# EAGLE design lightbar control (EAGLE 6.5.0)
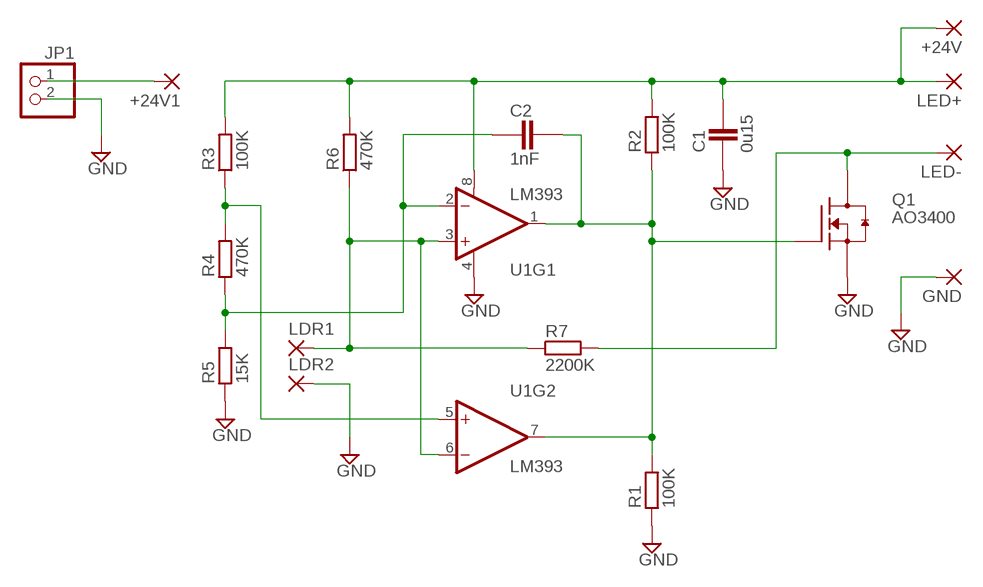
[diagram p0: schematic, sheet 1]

## Parts
+24V  SMD2  [SMD1,27-2,54]
+24V1  SMD2  [SMD1,27-2,54]
C1  0u15  CAPACITOR_0805  [CAPC2012X145AN]
C2  1nF  CAPACITOR_0603  [CAPC1608X92N]
GND  SMD2  [SMD1,27-2,54]
JP1  PINHD-1X2/90  [1X02/90]
LDR1  SMD2  [SMD1,27-2,54]
LDR2  SMD2  [SMD1,27-2,54]
LED+  SMD2  [SMD1,27-2,54]
LED-  SMD2  [SMD1,27-2,54]
Q1  AO3400  MOSFET-NCH_SOT-23  [SOT95P280X135-3N]
R1  100K  RESISTOR_0603  [RESC1608X55N]
R2  100K  RESISTOR_0603  [RESC1608X55N]
R3  100K  RESISTOR_0603  [RESC1608X55N]
R4  470K  RESISTOR_0603  [RESC1608X55N]
R5  15K  RESISTOR_0603  [RESC1608X55N]
R6  470K  RESISTOR_0603  [RESC1608X55N]
R7  2200K  RESISTOR_0805  [RESC2012X70N]
U1  LM393  [SO08]

## Nets
GND: C1.1 GND.1(P) JP1.2 LDR2.1(P) Q1.2(S) R1.1 R5.1 U1.4(V-)
N$1: C2.2 Q1.1(G) R1.2 R2.1 U1.1(OUT) U1.7(OUT)
N$2: LDR1.1(P) R6.1 R7.1 U1.3(+IN) U1.6(-IN)
N$3: R3.1 R4.2 U1.5(+IN)
N$4: +24V.1(P) C1.2 LED+.1(P) R2.2 R3.2 R6.2 U1.8(V+)
N$5: C2.1 R4.1 R5.2 U1.2(-IN)
N$6: LED-.1(P) Q1.3(D) R7.2
N$7: +24V1.1(P) JP1.1

## Library data of the parts
+24V +24V1 GND LDR1 LDR2 LED+ LED- = wirepad:SMD2: SMD PAD
C1 C2 = ipc-7351-capacitor:CAPACITOR_
JP1 = pinhead:PINHD-1X2: PIN HEADER
Q1 = ipc-7351-transistor:MOSFET-NCH_
R1-R7 = ipc-7351-resistor:RESISTOR_
U1 = SparkFun-AnalogIC:LM393: Low-voltage comparator

## Board
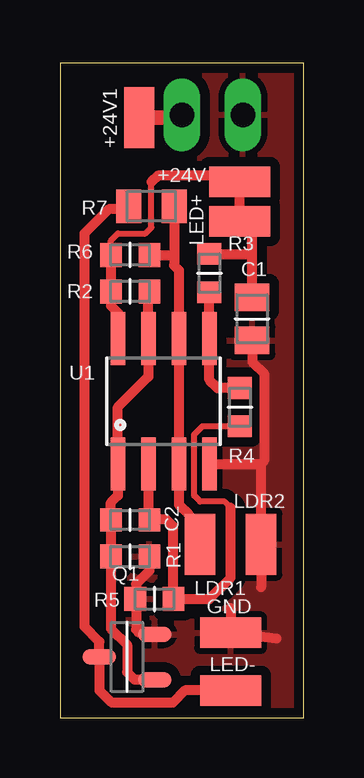
[diagram p1: board, top side]
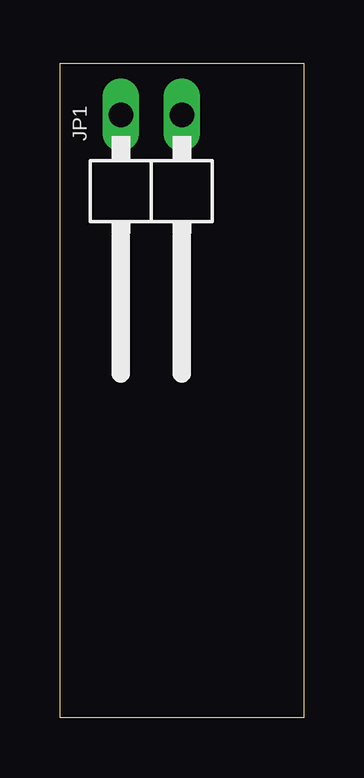
[diagram p2: board, bottom side, seen from below]

Size 10.16 x 27.3 mm. Coordinates in mm from the lower left corner, seen from the top.
Outline: 0,0 10.16,0 10.16,27.3 0,27.3 0,0
Copper layers (1*16): Top 0.035559375mm / dielectric 1.6mm / Bottom 0.035559375mm
Design rules "oshpark-2layer-tented-vias": minimum track width 6mil, minimum drill 10mil, track to track 6mil, track to pad 6mil, pad to pad 6mil, via to via 6mil, smd to smd 6mil, copper to edge 15mil, drill to drill 6mil, minimum pad ring 5mil, minimum via ring 5mil, stop-mask expansion 2.5mil, vias tented up to drill 13mil, thermal gap 10mil

### Footprints (pad centres in the part's own frame; a part is rotated, then mirrored left to right if it is on the bottom)
SMD1,27-2,54 = smd 1.27 x 2.54: 1 0,0
CAPC2012X145AN = smd 1.15 x 1.45: 1 -0.9,0; 2 0.9,0
CAPC1608X92N = smd 0.9 x 0.95: 1 -0.8,0; 2 0.8,0
1X02/90 = drill 1.016 long: 1 -1.27,-3.81; 2 1.27,-3.81
SOT95P280X135-3N = smd 1.4 x 0.65: 1 -1.15,0.95; 2 -1.15,-0.95; 3 1.15,0
RESC1608X55N = smd 0.9 x 1: 1 -0.8,0; 2 0.8,0
RESC2012X70N = smd 1.05 x 1.4: 1 -0.95,0; 2 0.95,0
SO08 = smd 0.61 x 2.21: 1 -1.905,-2.616; 2 -0.635,-2.616; 3 0.635,-2.616; 4 1.905,-2.616; 5 1.905,2.616; 6 0.635,2.616; 7 -0.635,2.616; 8 -1.905,2.616

### Placement (x,y rotation side)
+24V  7.49,22.35 90 top
+24V1  3.3,25.02 0 top
C1  8,16.64 90 top
C2  2.92,8.26 180 top
GND  7.11,3.56 270 top
JP1  6.35,21.34 180 bottom
LDR1  5.84,7.24 180 top
LDR2  8.38,7.24 180 top
LED+  7.49,20.7 90 top
LED-  7.11,1.14 270 top
Q1  2.79,2.54 180 top
R1  2.92,6.73 180 top
R2  2.92,17.78 180 top
R3  6.22,18.54 90 top
R4  7.49,12.95 90 top
R5  3.94,4.95 0 top
R6  2.92,19.3 180 top
R7  3.81,21.34 180 top
U1  4.32,13.21 0 top

### Tracks (layer width: path | path; a pad name or v marks a point on that pad's centre or on a via)
GND
  Top 0.406: R1.1 3.72,6.13 3.17,5.59 3.17,4.99 | 3.17,4.99 R5.1 | U1.4 8.38,10.59 | C1.1 8.01,15.75 8.01,14.85 8.51,14.35 8.51,10.72 8.38,10.59 | 8.38,10.59 LDR2.1 8.38,5.46 | 7.18,3.36 GND.1 | 7.11,4.57 GND.1 | 9.02,3.3 GND.1 | 3.17,4.99 3.17,3.68 3.3,3.56 3.88,3.56 Q1.2
  pour Top (isolate 0.406): 0.25,27.43 9.91,27.43 9.91,0 0.25,0
N$1
  Top 0.406: R2.1 3.68,17.74 U1.7 3.68,14.22 2.41,12.95 U1.1 2.41,9.27 2.12,8.98 C2.2 R1.2 2.12,3.72 2.79,3.05 2.79,1.91 3.11,1.59 Q1.1
N$2
  Top 0.406: LDR1.1 5.84,7.75 5.33,8.51 4.95,8.89 U1.3 U1.6 4.95,18.67 4.76,18.86 4.76,19.3 | R7.1 4.76,19.3 | R6.1 4.76,19.3
N$3
  Top 0.406: R3.1 U1.5 6.22,14.1 6.57,13.75 R4.2
N$4
  Top 0.254: R6.2 2.12,19.9 2.41,20.19 3.56,20.19 3.81,20.45 3.81,22.35
  Top 0.406: R6.2 R2.2 2.12,17.18 2.41,16.89 U1.8 | 3.81,22.35 4.06,22.61 7.24,22.61 +24V.1 LED+.1 8,20.7 8,19.43 | C1.2 8,19.43 | R3.2 7.91,19.34 8,19.43
N$5
  Top 0.254: R4.1 5.93,12.15 5.59,11.81 5.59,9.27 5.84,9.02 6.86,9.02 7.11,8.76
  Top 0.406: 7.11,8.76 7.11,5.84 6.22,4.95 R5.2 4.7,4.99 4.7,8 4.41,8.29 3.68,8.29 | U1.2 3.68,8.29 | 3.68,8.29 C2.1
N$6
  Top 0.406: R7.2 2.86,21.27 2.79,21.21 2.03,21.21 1.02,20.19 1.02,3.81 1.64,3.18 Q1.3 1.64,1.15 2.16,0.64 4.7,0.64 5.21,1.14 LED-.1
N$7
  Top 0.61: +24V1.1 4.95,25.02 JP1.1